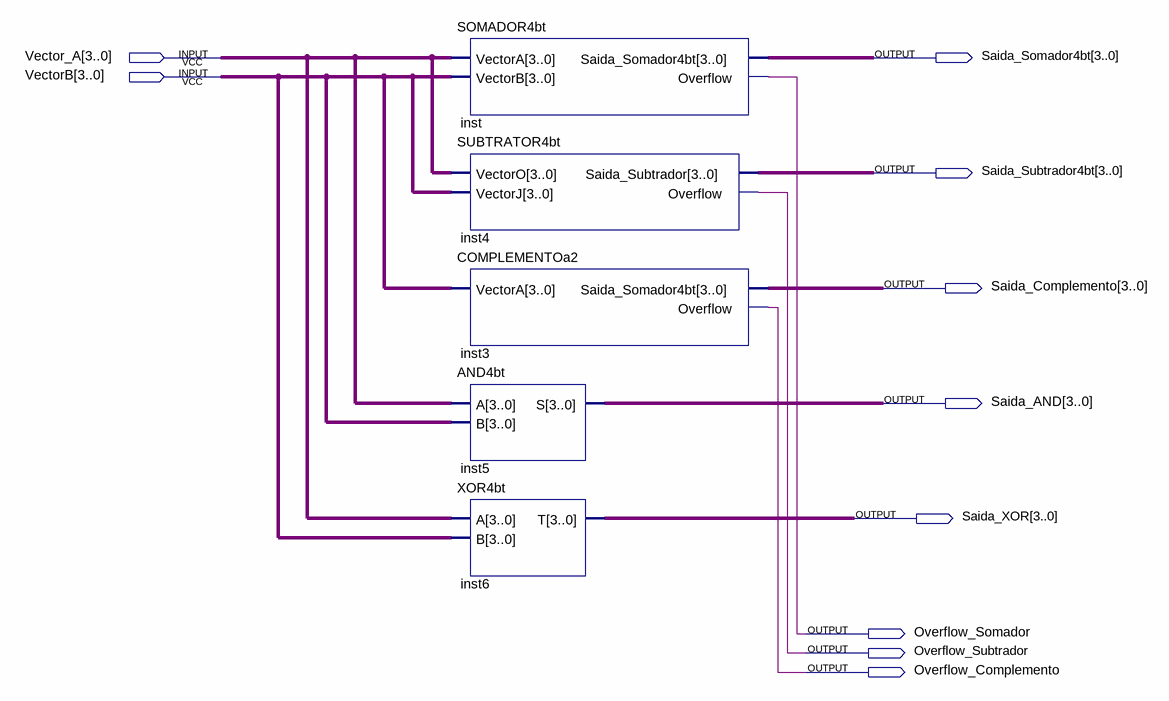
[diagram p0: schematic sheet]
// Quartus schematic FuncoesVec.bdf as structural Verilog: 5 symbols, 10 pins
module FuncoesVec (
  input  [3:0] Vector_A,
  input  [3:0] VectorB,
  output [3:0] Saida_Somador4bt,
  output [3:0] Saida_Subtrador4bt,
  output [3:0] Saida_Complemento,
  output [3:0] Saida_AND,
  output [3:0] Saida_XOR,
  output Overflow_Somador,
  output Overflow_Subtrador,
  output Overflow_Complemento
);

  SOMADOR4bt inst (
    .VectorA(Vector_A), .VectorB(VectorB), .Saida_Somador4bt(Saida_Somador4bt), .Overflow(Overflow_Somador));
  SUBTRATOR4bt inst4 (
    .VectorO(Vector_A), .VectorJ(VectorB), .Saida_Subtrador(Saida_Subtrador4bt), .Overflow(Overflow_Subtrador));
  COMPLEMENTOa2 inst3 (.VectorA(VectorB), .Saida_Somador4bt(Saida_Complemento), .Overflow(Overflow_Complemento));
  AND4bt inst5 (.A(Vector_A), .B(VectorB), .S(Saida_AND));
  XOR4bt inst6 (.A(Vector_A), .B(VectorB), .T(Saida_XOR));
endmodule
